# EAGLE design Home_Control (EAGLE 9.6.2)
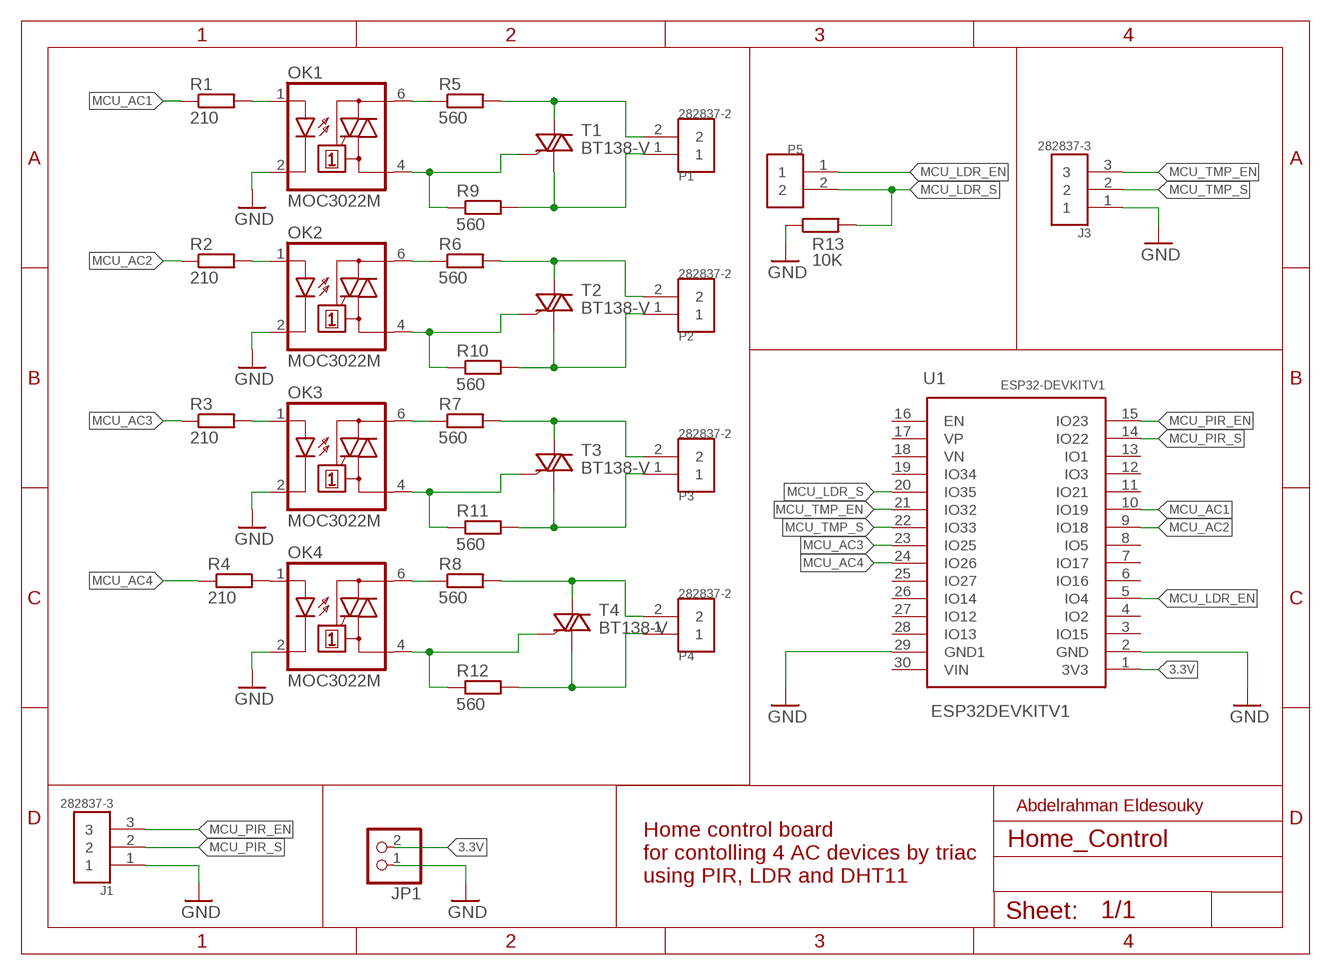
[diagram p0: schematic, sheet 1]

## Parts
J1  282837-3  [TE_282837-3]
J3  282837-3  [TE_282837-3]
JP1  PINHD-1X2  [1X02]
OK1  MOC3022M  [DIL06]
OK2  MOC3022M  [DIL06]
OK3  MOC3022M  [DIL06]
OK4  MOC3022M  [DIL06]
P1  282837-2  [TE_282837-2]
P2  282837-2  [TE_282837-2]
P3  282837-2  [TE_282837-2]
P4  282837-2  [TE_282837-2]
P5  282837-2  [TE_282837-2]
R1  210  R-EU_0411/15  [0411/15]
R2  210  R-EU_0411/15  [0411/15]
R3  210  R-EU_0411/15  [0411/15]
R4  210  R-EU_0411/15  [0411/15]
R5  560  R-EU_0411/15  [0411/15]
R6  560  R-EU_0411/15  [0411/15]
R7  560  R-EU_0411/15  [0411/15]
R8  560  R-EU_0411/15  [0411/15]
R9  560  R-EU_0411/15  [0411/15]
R10  560  R-EU_0411/15  [0411/15]
R11  560  R-EU_0411/15  [0411/15]
R12  560  R-EU_0411/15  [0411/15]
R13  10K  R-EU_0411/15  [0411/15]
T1  BT138-V  [TO220BV]
T2  BT138-V  [TO220BV]
T3  BT138-V  [TO220BV]
T4  BT138-V  [TO220BV]
U1  ESP32DEVKITV1  [ESP32-DEVKITV1]

## Nets
3.3V: JP1.2 U1.1(3V3)
GND: J1.1 J3.1 JP1.1 OK1.2(C) OK2.2(C) OK3.2(C) OK4.2(C) R13.1 U1.2(GND) U1.29(GND1)
MCU_AC1: R1.1 U1.10(IO19)
MCU_AC2: R2.1 U1.9(IO18)
MCU_AC3: R3.1 U1.23(IO25)
MCU_AC4: R4.1 U1.24(IO26)
MCU_LDR_EN: P5.1 U1.5(IO4)
MCU_LDR_S: P5.2 R13.2 U1.20(IO35)
MCU_PIR_EN: J1.3 U1.15(IO23)
MCU_PIR_S: J1.2 U1.14(IO22)
MCU_TMP_EN: J3.3 U1.21(IO32)
MCU_TMP_S: J3.2 U1.22(IO33)
N$1: OK1.1(A) R1.2
N$2: OK2.1(A) R2.2
N$3: OK3.1(A) R3.2
N$4: OK4.1(A) R4.2
N$5: OK1.4(A1) R9.1 T1.G
N$6: OK2.4(A1) R10.1 T2.G
N$7: OK3.4(A1) R11.1 T3.G
N$8: OK4.4(A1) R12.1 T4.G
N$9: OK1.6(A2) R5.1
N$10: P1.2 R5.2 T1.T2(A2)
N$11: OK2.6(A2) R6.1
N$12: P2.2 R6.2 T2.T2(A2)
N$13: OK3.6(A2) R7.1
N$14: P3.2 R7.2 T3.T2(A2)
N$15: OK4.6(A2) R8.1
N$16: P4.2 R8.2 T4.T2(A2)
N$17: P1.1 R9.2 T1.T1(A1)
N$19: P2.1 R10.2 T2.T1(A1)
N$21: P3.1 R11.2 T3.T1(A1)
N$23: P4.1 R12.2 T4.T1(A1)
Unconnected: U1.3(IO15) U1.4(IO2) U1.6(IO16) U1.7(IO17) U1.8(IO5) U1.11(IO21) U1.12(IO3) U1.13(IO1) U1.16(EN) U1.17(VP) U1.18(VN) U1.19(IO34) U1.25(IO27) U1.26(IO14) U1.27(IO12) U1.28(IO13) U1.30(VIN)

## Notes on the sheet
- Abdelrahman Eldesouky
- Home control board 
  for contolling 4 AC devices by triac
  using PIR, LDR and DHT11

## Library data of the parts
J1 J3 = 282837-3:282837-3: TERMI-BLOK PCB MOUNT 3P Check availability <https://pricing.snapeda.com/parts/282837-3/TE%20Connectivity/view-part?ref=eda>; AVAILABILITY: In Stock; COMMENT: 282837-3; DESCRIPTION: Wire to Board 3 Position 5.08 mm Pitch 30-16 AWG Euro Style Terminal Block; MF: TE Connectivity; MP: 282837-3; PACKAGE: None; PRICE: None; PURCHASE-URL: https://pricing.snapeda.com/search/part/282837-3/?ref=eda
JP1 = pinhead:PINHD-1X2: PIN HEADER
OK1-OK4 = optocoupler:MOC30*M: RANDOM-PHASE OPTOISOLATORS TRIAC DRIVER OUTPUT Source: http://www.fairchildsemi.com MOC3020-M.pdf; MF: FAIRCHILD SEMICONDUCTOR; MPN: MOC3022-M; OC_FARNELL: 1021086; OC_NEWARK: 58K1956
P1-P5 = 282837-2:282837-2: TERM BLOCK 5.08MM 2POS SIDE ENTY Check availability <https://pricing.snapeda.com/parts/282837-2/TE%20Connectivity/view-part?ref=eda>; AVAILABILITY: In Stock; COMMENT: 282837-2; DESCRIPTION: Connector Terminal Blocks Receptacle 2 Position 5.08mm Solder Straight Thru-Hole 13.5A/Contact; EU_ROHS_COMPLIANCE: Compliant with Exemptions; MF: TE Connectivity; MP: 282837-2; PACKAGE: None; PRICE: None; PURCHASE-URL: https://pricing.snapeda.com/search/part/282837-2/?ref=eda
R1-R13 = rcl:R-EU_: RESISTOR, European symbol; SPICEPREFIX: R
T1-T4 = triac:BT138: TRIAC Source: http://www.semiconductors.philips.com BT138_SERIES_2.pdf
U1 = ESP32-DEVKITV1:ESP32DEVKITV1

## Board
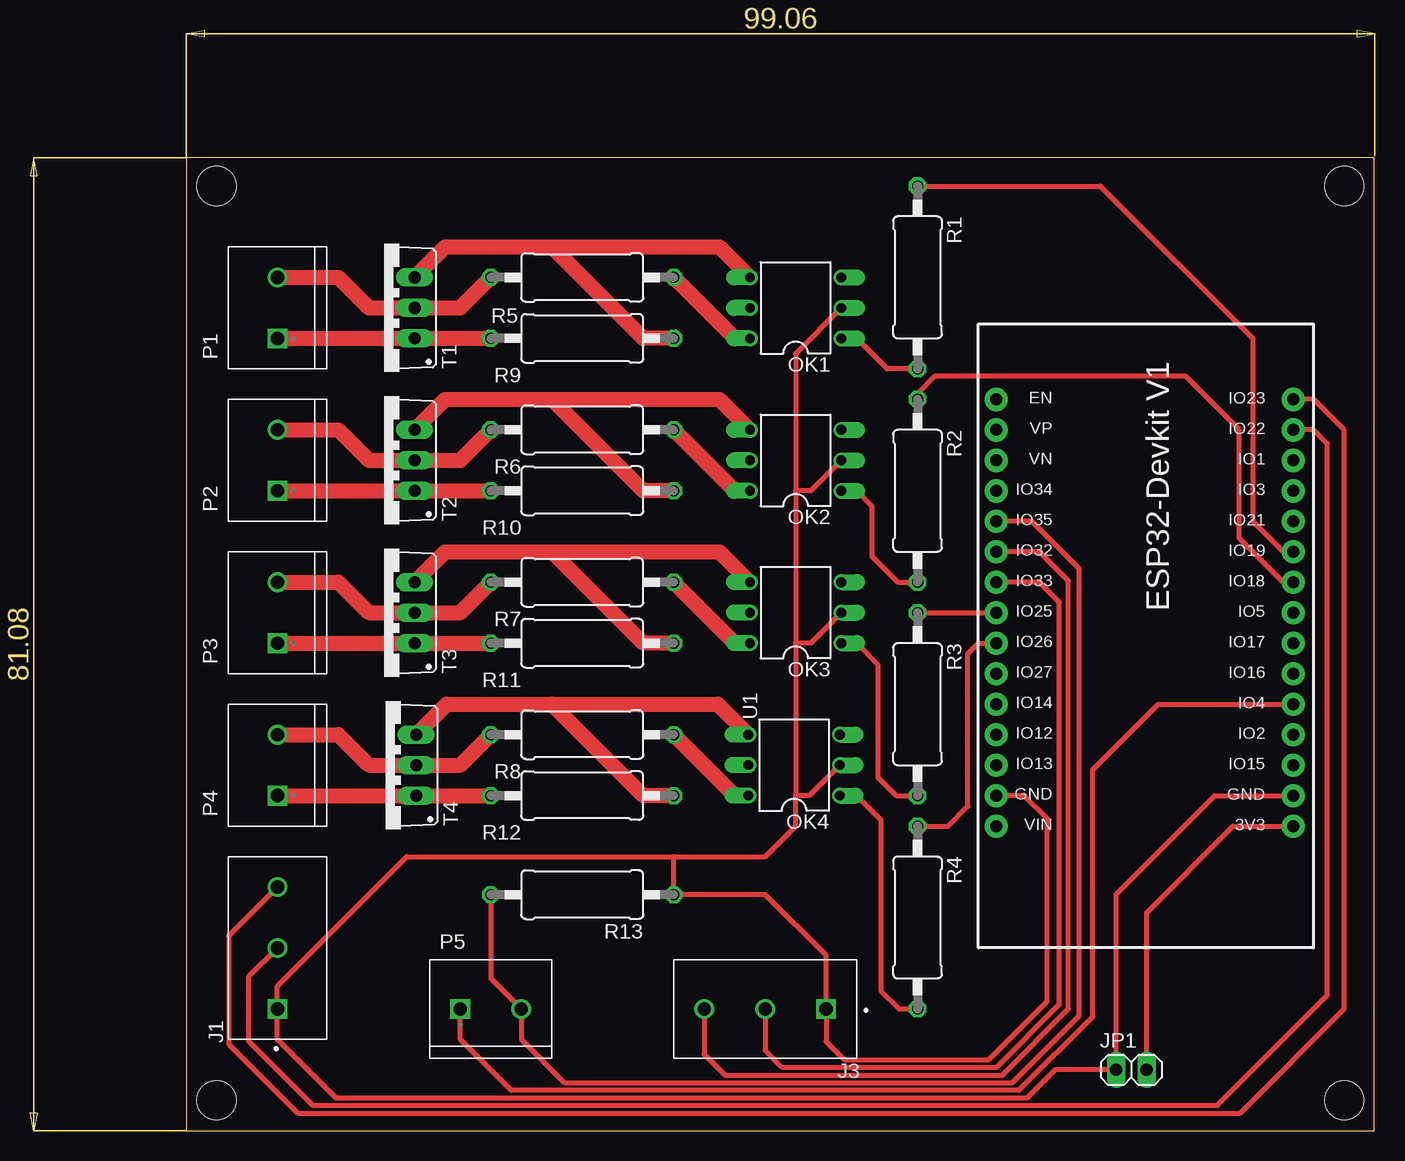
[diagram p1: board, top side]

Size 99.04 x 81.08 mm. Coordinates in mm from the lower left corner, seen from the top.
Outline: 0,0 99.04,0 99.04,81.08 0,81.08 0,0
Copper layers (1*16): Top 0.035mm / dielectric 1.5mm / Bottom 0.035mm
Design rules "default": minimum track width 6mil, minimum drill 0.35mm, track to track 6mil, track to pad 6mil, pad to pad 6mil, via to via 6mil, smd to smd 6mil, copper to edge 40mil, drill to drill 6mil, minimum pad ring 10mil, minimum via ring 8mil, stop-mask expansion 4mil, vias tented up to drill 0mil, thermal gap 10mil
Holes 3.25 mm at 2.54,78.74 96.52,78.74 2.54,2.54 96.52,2.54

### Footprints (pad centres in the part's own frame; a part is rotated, then mirrored left to right if it is on the bottom)
TE_282837-3 = drill 1.1 square: 1 -5.08,0 | drill 1.1: 2 0,0; 3 5.08,0
1X02 = drill 1.016 long: 1 -1.27,0; 2 1.27,0
DIL06 = drill 0.813 offset: 1 -2.54,-3.81; 2 0,-3.81; 3 2.54,-3.81; 4 2.54,3.81; 5 0,3.81; 6 -2.54,3.81
TE_282837-2 = drill 1.1 square: 1 -2.54,0 | drill 1.1: 2 2.54,0
0411/15 = drill 0.914 octagon: 1 -7.62,0; 2 7.62,0
TO220BV = drill 1.016 long: G 2.54,-2.54; T1 -2.54,-2.54; T2 0,-2.54
ESP32-DEVKITV1 = drill 1 pad 1.93: 1 -22.87,-13.54; 2 -20.33,-13.54; 3 -17.79,-13.54; 4 -15.25,-13.54; 5 -12.71,-13.54; 6 -10.17,-13.54; 7 -7.63,-13.54; 8 -5.09,-13.54; 9 -2.55,-13.54; 10 -0.01,-13.54; 11 2.53,-13.54; 12 5.07,-13.54; 13 7.61,-13.54; 14 10.15,-13.54; 15 12.69,-13.54; 16 12.69,11.23; 17 10.15,11.23; 18 7.61,11.23; 19 5.07,11.23; 20 2.53,11.23; 21 -0.01,11.23; 22 -2.55,11.23; 23 -5.09,11.23; 24 -7.63,11.23; 25 -10.17,11.23; 26 -12.71,11.23; 27 -15.25,11.23; 28 -17.79,11.23; 29 -20.33,11.23; 30 -22.87,11.23

### Placement (x,y rotation side)
J1  7.62,15.24 90 top
J3  48.26,10.16 180 top
JP1  78.77,5.09 0 top
OK1  50.8,68.58 90 top
OK2  50.8,55.88 90 top
OK3  50.8,43.18 90 top
OK4  50.67,30.48 90 top
P1  7.62,68.58 90 top
P2  7.62,55.88 90 top
P3  7.62,43.18 90 top
P4  7.62,30.48 90 top
P5  25.4,10.16 0 top
R1  60.96,71.12 270 top
R2  60.96,53.34 270 top
R3  60.96,35.56 270 top
R4  60.96,17.78 270 top
R5  33.02,71.12 180 top
R6  33.02,58.42 180 top
R7  33.02,45.72 180 top
R8  33.02,33.02 180 top
R9  33.02,66.04 180 top
R10  33.02,53.34 180 top
R11  33.02,40.64 180 top
R12  33.02,27.94 180 top
R13  33.02,19.68 180 top
T1  16.51,68.58 90 top
T2  16.51,55.88 90 top
T3  16.51,43.18 90 top
T4  16.64,30.48 90 top
U1  78.74,48.26 90 top

### Tracks (layer width: path | path; a pad name or v marks a point on that pad's centre or on a via)
3.3V
  Top 0.406: JP1.2 80.04,18.19 87.25,25.4 U1.1
GND
  Top 0.406: OK1.2 50.8,64.77 50.8,53.34 | 50.8,53.34 50.8,40.64 | 50.8,40.64 50.8,27.94 | OK4.2 51.94,27.94 50.8,27.94 | OK3.2 52.07,40.64 50.8,40.64 | OK2.2 52.07,53.34 50.8,53.34 | 50.8,27.94 50.8,25.4 48.26,22.86 40.64,22.86 | 40.64,22.86 18.41,22.86 7.62,12.06 J1.1 7.62,7.62 12.51,2.73 70.07,2.73 72.42,5.09 JP1.1 77.5,19.72 85.72,27.94 U1.2 | U1.29 69.86,27.93 71.75,26.04 71.75,10.79 66.89,5.93 54.84,5.93 53.34,7.43 J3.1 53.34,14.63 48.28,19.68 R13.1 40.64,22.86
MCU_AC1
  Top 0.406: R1.1 76.2,78.74 88.9,66.04 88.9,50.8 91.45,48.25 U1.10
MCU_AC2
  Top 0.406: U1.9 91.44,45.71 87.76,49.39 87.76,58.42 83.31,62.87 62.36,62.87 60.96,61.47 R2.1
MCU_AC3
  Top 0.406: U1.23 R3.1
MCU_AC4
  Top 0.406: R4.1 63.5,25.4 65.15,27.05 65.15,39.75 66.04,40.64 U1.24
MCU_LDR_EN
  Top 0.406: U1.5 81.02,35.55 75.56,30.1 75.56,9.53 69.41,3.37 27.11,3.37 22.86,7.62 P5.1
MCU_LDR_S
  Top 0.406: U1.20 70.48,50.8 74.42,46.86 74.42,9.6 68.85,4.03 31.53,4.03 27.94,7.62 P5.2 25.4,12.7 R13.2
MCU_PIR_EN
  Top 0.406: J1.3 3.56,16.26 3.56,7.24 9.32,1.48 87.83,1.48 96.52,10.16 96.52,58.42 93.99,60.95 U1.15
MCU_PIR_S
  Top 0.406: J1.2 5.21,12.83 5.21,7.49 10.58,2.12 85.94,2.12 95.12,11.3 95.12,57.28 93.98,58.42 U1.14
MCU_TMP_EN
  Top 0.406: U1.21 71.12,48.26 73.53,45.85 73.53,10.16 68,4.63 44.95,4.63 43.18,6.4 J3.3
MCU_TMP_S
  Top 0.406: U1.22 71.12,45.72 72.77,44.07 72.77,10.54 67.51,5.28 49.7,5.28 48.26,6.72 J3.2
N$1
  Top 0.406: R1.2 58.42,63.5 55.88,66.04 OK1.1
N$2
  Top 0.406: OK2.1 55.88,53.34 57.15,52.07 57.15,47.88 59.31,45.72 R2.2
N$3
  Top 0.406: OK3.1 55.88,40.64 57.66,38.86 57.66,29.46 59.18,27.94 R3.2
N$4
  Top 0.406: OK4.1 55.88,27.94 57.91,25.91 57.91,11.68 59.44,10.16 R4.2
N$5
  Top 1.27: T1.G 21.59,73.66 30.48,73.66 | OK1.4 44.45,73.66 30.48,73.66 | R9.1 38.1,66.04 30.48,73.66
N$6
  Top 1.27: T2.G 21.59,60.96 30.48,60.96 | OK2.4 44.45,60.96 30.48,60.96 | R10.1 38.1,53.34 30.48,60.96
N$7
  Top 1.27: T3.G 21.59,48.26 30.48,48.26 | OK3.4 44.45,48.26 30.48,48.26 | R11.1 38.1,40.64 30.48,48.26
N$8
  Top 1.27: T4.G 21.72,35.56 30.48,35.56 | OK4.4 44.32,35.56 30.48,35.56 | R12.1 38.1,27.94 30.48,35.56
N$9
  Top 1.27: R5.1 45.72,66.04 OK1.6
N$10
  Top 1.27: P1.2 12.7,71.12 15.24,68.58 T1.T2 22.86,68.58 R5.2
N$11
  Top 1.27: R6.1 45.72,53.34 OK2.6
N$12
  Top 1.27: P2.2 12.7,58.42 15.24,55.88 T2.T2 22.86,55.88 R6.2
N$13
  Top 1.27: R7.1 45.72,40.64 OK3.6
N$14
  Top 1.27: P3.2 12.7,45.72 15.24,43.18 T3.T2 22.86,43.18 R7.2
N$15
  Top 1.27: R8.1 45.72,27.94 OK4.6
N$16
  Top 1.27: P4.2 12.7,33.02 15.24,30.48 T4.T2 22.86,30.48 R8.2
N$17
  Top 1.27: P1.1 T1.T1 R9.2
N$19
  Top 1.27: P2.1 T2.T1 R10.2
N$21
  Top 1.27: P3.1 T3.T1 R11.2
N$23
  Top 1.27: P4.1 T4.T1 R12.2